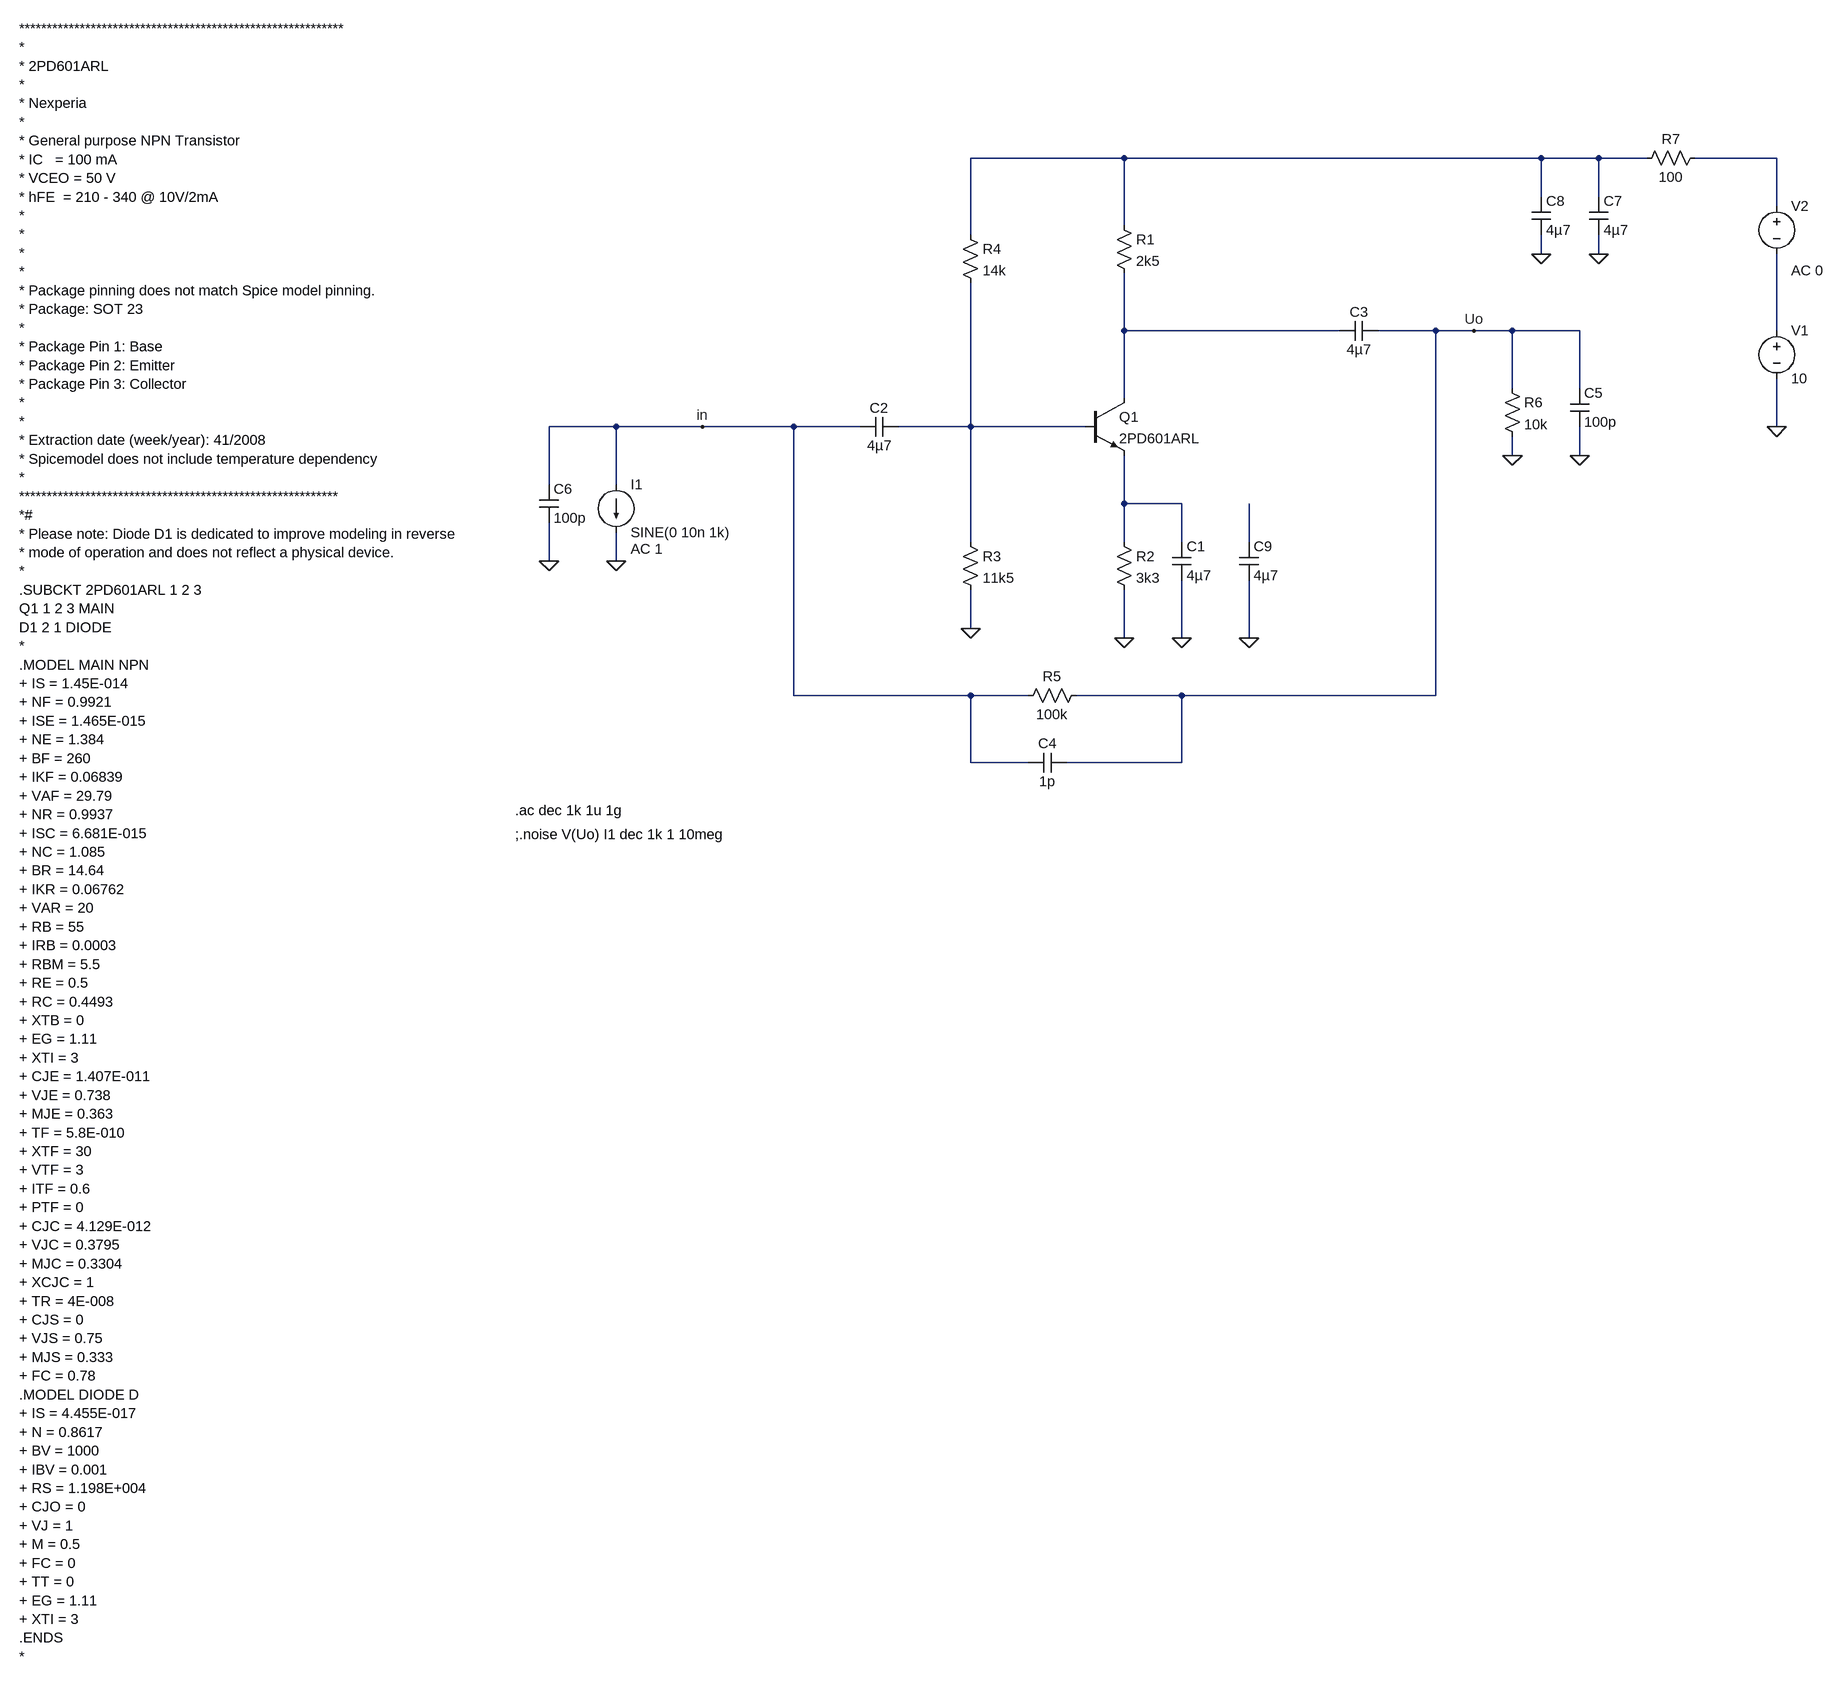
[diagram p0: schematic howNotTo.asc]
howNotTo.asc, the LTspice schematic file:
Version 4
SHEET 1 3300 2512
WIRE 2000 256 1744 256
WIRE 2720 256 2000 256
WIRE 2816 256 2720 256
WIRE 2896 256 2816 256
WIRE 3216 256 2976 256
WIRE 2720 320 2720 256
WIRE 2816 320 2816 256
WIRE 3216 336 3216 256
WIRE 2000 368 2000 256
WIRE 1744 384 1744 256
WIRE 2720 416 2720 384
WIRE 2816 416 2816 384
WIRE 2000 544 2000 448
WIRE 2384 544 2000 544
WIRE 2544 544 2448 544
WIRE 2608 544 2544 544
WIRE 2672 544 2608 544
WIRE 2784 544 2672 544
WIRE 3216 544 3216 416
WIRE 2672 640 2672 544
WIRE 2784 640 2784 544
WIRE 2000 656 2000 544
WIRE 960 704 848 704
WIRE 1104 704 960 704
WIRE 1376 704 1104 704
WIRE 1488 704 1376 704
WIRE 1744 704 1744 464
WIRE 1744 704 1552 704
WIRE 1936 704 1744 704
WIRE 3216 704 3216 624
WIRE 2672 752 2672 720
WIRE 2784 752 2784 704
WIRE 848 800 848 704
WIRE 960 800 960 704
WIRE 2000 832 2000 752
WIRE 2096 832 2000 832
WIRE 1744 896 1744 704
WIRE 2000 896 2000 832
WIRE 2096 896 2096 832
WIRE 2208 896 2208 832
WIRE 848 928 848 864
WIRE 960 928 960 880
WIRE 1744 1040 1744 976
WIRE 2000 1056 2000 976
WIRE 2096 1056 2096 960
WIRE 2208 1056 2208 960
WIRE 1376 1152 1376 704
WIRE 1744 1152 1376 1152
WIRE 1840 1152 1744 1152
WIRE 2096 1152 1920 1152
WIRE 2544 1152 2544 544
WIRE 2544 1152 2096 1152
WIRE 1744 1264 1744 1152
WIRE 1840 1264 1744 1264
WIRE 2096 1264 2096 1152
WIRE 2096 1264 1904 1264
FLAG 2672 752 0
FLAG 2784 752 0
FLAG 2000 1056 0
FLAG 2096 1056 0
FLAG 1744 1040 0
FLAG 3216 704 0
FLAG 848 928 0
FLAG 960 928 0
FLAG 1104 704 in
FLAG 2608 544 Uo
FLAG 2720 416 0
FLAG 2816 416 0
FLAG 2208 1056 0
SYMBOL npn 1936 656 R0
SYMATTR InstName Q1
SYMATTR Value 2PD601ARL
SYMATTR Prefix X
SYMBOL res 1984 352 R0
SYMATTR InstName R1
SYMATTR Value 2k5
SYMBOL res 1984 880 R0
SYMATTR InstName R2
SYMATTR Value 3k3
SYMBOL cap 2080 896 R0
SYMATTR InstName C1
SYMATTR Value 4µ7
SYMBOL res 1728 880 R0
SYMATTR InstName R3
SYMATTR Value 11k5
SYMBOL res 1728 368 R0
SYMATTR InstName R4
SYMATTR Value 14k
SYMBOL cap 1552 688 R90
WINDOW 0 0 32 VBottom 2
WINDOW 3 32 32 VTop 2
SYMATTR InstName C2
SYMATTR Value 4µ7
SYMBOL cap 2448 528 R90
WINDOW 0 0 32 VBottom 2
WINDOW 3 32 32 VTop 2
SYMATTR InstName C3
SYMATTR Value 4µ7
SYMBOL cap 1904 1248 R90
WINDOW 0 0 32 VBottom 2
WINDOW 3 32 32 VTop 2
SYMATTR InstName C4
SYMATTR Value 1p
SYMBOL res 1936 1136 R90
WINDOW 0 0 56 VBottom 2
WINDOW 3 32 56 VTop 2
SYMATTR InstName R5
SYMATTR Value 100k
SYMBOL res 2656 624 R0
SYMATTR InstName R6
SYMATTR Value 10k
SYMBOL cap 2768 640 R0
SYMATTR InstName C5
SYMATTR Value 100p
SYMBOL voltage 3216 528 R0
WINDOW 123 0 0 Left 0
WINDOW 39 0 0 Left 0
SYMATTR InstName V1
SYMATTR Value 10
SYMBOL voltage 3216 320 R0
WINDOW 3 24 96 Invisible 2
WINDOW 123 24 124 Left 2
WINDOW 39 0 0 Left 0
SYMATTR Value 0
SYMATTR Value2 AC 0
SYMATTR InstName V2
SYMBOL current 960 800 R0
WINDOW 123 24 108 Left 2
WINDOW 39 0 0 Left 0
SYMATTR Value2 AC 1
SYMATTR InstName I1
SYMATTR Value SINE(0 10n 1k)
SYMBOL cap 832 800 R0
SYMATTR InstName C6
SYMATTR Value 100p
SYMBOL res 2992 240 R90
WINDOW 0 0 56 VBottom 2
WINDOW 3 32 56 VTop 2
SYMATTR InstName R7
SYMATTR Value 100
SYMBOL cap 2800 320 R0
SYMATTR InstName C7
SYMATTR Value 4µ7
SYMBOL cap 2704 320 R0
SYMATTR InstName C8
SYMATTR Value 4µ7
SYMBOL cap 2192 896 R0
SYMATTR InstName C9
SYMATTR Value 4µ7
TEXT -200 40 Left 2 !***********************************************************\n*\n* 2PD601ARL\n*\n* Nexperia\n*\n* General purpose NPN Transistor\n* IC   = 100 mA\n* VCEO = 50 V \n* hFE  = 210 - 340 @ 10V/2mA\n*\n*\n*\n*\n* Package pinning does not match Spice model pinning.\n* Package: SOT 23\n* \n* Package Pin 1: Base\n* Package Pin 2: Emitter\n* Package Pin 3: Collector\n*\n*\n* Extraction date (week/year): 41/2008  \n* Spicemodel does not include temperature dependency\n*\n**********************************************************\n*#\n* Please note: Diode D1 is dedicated to improve modeling in reverse\n* mode of operation and does not reflect a physical device.\n*\n.SUBCKT 2PD601ARL 1 2 3\nQ1 1 2 3 MAIN\nD1 2 1 DIODE\n*\n.MODEL MAIN NPN \n+ IS = 1.45E-014 \n+ NF = 0.9921 \n+ ISE = 1.465E-015 \n+ NE = 1.384 \n+ BF = 260 \n+ IKF = 0.06839 \n+ VAF = 29.79 \n+ NR = 0.9937 \n+ ISC = 6.681E-015 \n+ NC = 1.085 \n+ BR = 14.64 \n+ IKR = 0.06762 \n+ VAR = 20 \n+ RB = 55 \n+ IRB = 0.0003 \n+ RBM = 5.5 \n+ RE = 0.5 \n+ RC = 0.4493 \n+ XTB = 0 \n+ EG = 1.11 \n+ XTI = 3 \n+ CJE = 1.407E-011 \n+ VJE = 0.738 \n+ MJE = 0.363 \n+ TF = 5.8E-010 \n+ XTF = 30 \n+ VTF = 3 \n+ ITF = 0.6 \n+ PTF = 0 \n+ CJC = 4.129E-012 \n+ VJC = 0.3795 \n+ MJC = 0.3304 \n+ XCJC = 1 \n+ TR = 4E-008 \n+ CJS = 0 \n+ VJS = 0.75 \n+ MJS = 0.333 \n+ FC = 0.78 \n.MODEL DIODE D \n+ IS = 4.455E-017 \n+ N = 0.8617 \n+ BV = 1000 \n+ IBV = 0.001 \n+ RS = 1.198E+004 \n+ CJO = 0 \n+ VJ = 1 \n+ M = 0.5 \n+ FC = 0 \n+ TT = 0 \n+ EG = 1.11 \n+ XTI = 3 \n.ENDS\n*
TEXT 792 1344 Left 2 !.ac dec 1k 1u 1g
TEXT 792 1384 Left 2 !;.noise V(Uo) I1 dec 1k 1 10meg

The netlist it stands for:
* howNotTo.asc
XQ1 N003 N005 N006 2PD601ARL  ; pins C B E
R1 N001 N003 2k5
R2 N006 0 3k3
C1 N006 0 4µ7
R3 N005 0 11k5
R4 N001 N005 14k
C2 N005 in 4µ7
C3 Uo N003 4µ7
C4 Uo in 1p
R5 Uo in 100k
R6 Uo 0 10k
C5 Uo 0 100p
V1 N004 0 10
V2 N002 N004 0 AC 0
I1 in 0 SINE(0 10n 1k) AC 1
C6 in 0 100p
R7 N002 N001 100
C7 N001 0 4µ7
C8 N001 0 4µ7
C9 N007 0 4µ7
***********************************************************
*
* 2PD601ARL
*
* Nexperia
*
* General purpose NPN Transistor
* IC   = 100 mA
* VCEO = 50 V
* hFE  = 210 - 340 @ 10V/2mA
*
*
*
*
* Package pinning does not match Spice model pinning.
* Package: SOT 23
*
* Package Pin 1: Base
* Package Pin 2: Emitter
* Package Pin 3: Collector
*
*
* Extraction date (week/year): 41/2008
* Spicemodel does not include temperature dependency
*
**********************************************************
*#
* Please note: Diode D1 is dedicated to improve modeling in reverse
* mode of operation and does not reflect a physical device.
*
.SUBCKT 2PD601ARL 1 2 3
Q1 1 2 3 MAIN
D1 2 1 DIODE
*
.MODEL MAIN NPN
+ IS = 1.45E-014
+ NF = 0.9921
+ ISE = 1.465E-015
+ NE = 1.384
+ BF = 260
+ IKF = 0.06839
+ VAF = 29.79
+ NR = 0.9937
+ ISC = 6.681E-015
+ NC = 1.085
+ BR = 14.64
+ IKR = 0.06762
+ VAR = 20
+ RB = 55
+ IRB = 0.0003
+ RBM = 5.5
+ RE = 0.5
+ RC = 0.4493
+ XTB = 0
+ EG = 1.11
+ XTI = 3
+ CJE = 1.407E-011
+ VJE = 0.738
+ MJE = 0.363
+ TF = 5.8E-010
+ XTF = 30
+ VTF = 3
+ ITF = 0.6
+ PTF = 0
+ CJC = 4.129E-012
+ VJC = 0.3795
+ MJC = 0.3304
+ XCJC = 1
+ TR = 4E-008
+ CJS = 0
+ VJS = 0.75
+ MJS = 0.333
+ FC = 0.78
.MODEL DIODE D
+ IS = 4.455E-017
+ N = 0.8617
+ BV = 1000
+ IBV = 0.001
+ RS = 1.198E+004
+ CJO = 0
+ VJ = 1
+ M = 0.5
+ FC = 0
+ TT = 0
+ EG = 1.11
+ XTI = 3
.ENDS
*
.ac dec 1k 1u 1g
;.noise V(Uo) I1 dec 1k 1 10meg
.backanno
.end